# EAGLE design sane_serial (EAGLE 9.6.2)
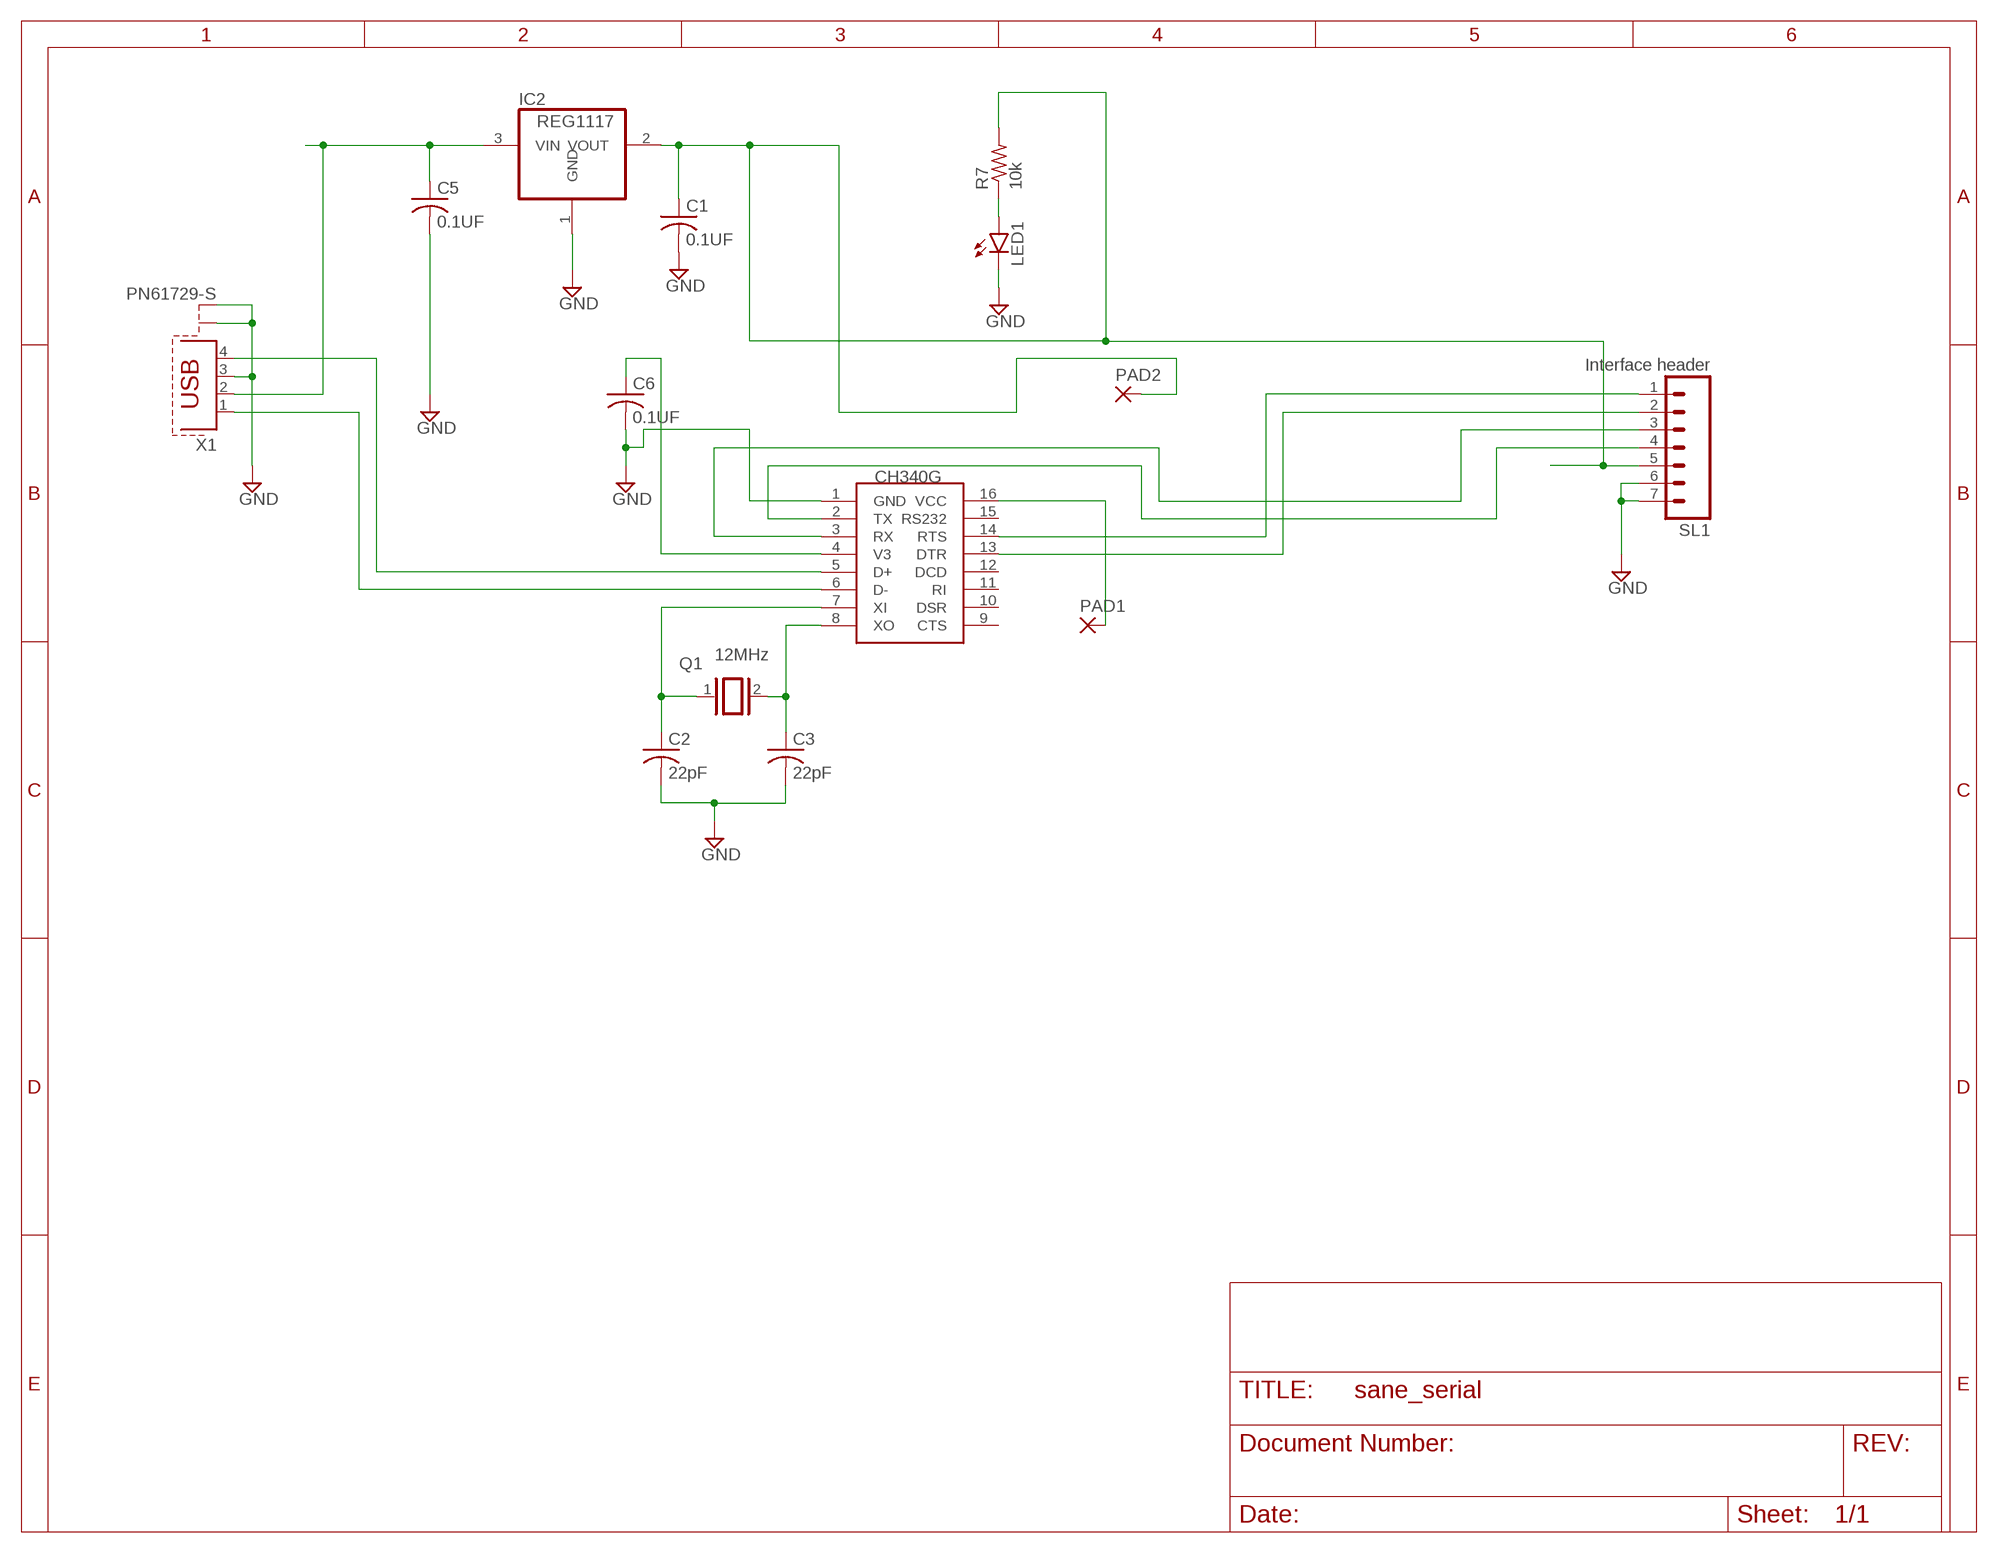
[diagram p0: schematic, sheet 1]

## Parts
C1  0.1UF  C-US050-024X044  [C050-024X044]
C2  22pF  C-US050-024X044  [C050-024X044]
C3  22pF  C-US050-024X044  [C050-024X044]
C5  0.1UF  C-US050-024X044  [C050-024X044]
C6  0.1UF  C-US050-024X044  [C050-024X044]
IC2  REG1117  [SOT223]
LED1  LED5MM  [LED5MM]
PAD1  1,6/0,9  [1,6/0,9]
PAD2  1,6/0,9  [1,6/0,9]
Q1  12MHz  XTAL/S  [QS]
R7  10k  R-US_0204/7  [0204/7]
SL1  Interface header  M07  [07P]
U$1  CH340G  [SOIC16]
X1  PN61729-S  [PN61729-S]

## Nets
GND: C1.2 C2.2 C3.2 C5.2 C6.2 IC2.1(GND) LED1.K(C) SL1.6 SL1.7 U$1.1(GND) X1.3 X1.S1 X1.S2
N$1: U$1.5(D+) X1.4
N$3: SL1.2 U$1.13(DTR)
N$4: SL1.1 U$1.14(RTS)
N$5: SL1.4 U$1.2(TX)
N$6: SL1.3 U$1.3(RX)
N$7: U$1.6(D-) X1.1
N$8: C2.1 Q1.1 U$1.7(XI)
N$9: C3.1 Q1.2 U$1.8(XO)
N$10: C6.1 U$1.4(V3)
N$11: PAD1.1(P) U$1.16(VCC)
N$13: C1.1 IC2.2(VOUT) PAD2.1(P) R7.2 SL1.5
N$14: LED1.A R7.1
N$16: C5.1 IC2.3(VIN) X1.2
Unconnected: U$1.9(CTS) U$1.10(DSR) U$1.11(RI) U$1.12(DCD) U$1.15(RS232)

## Library data of the parts
C1-C3 C5 C6 = rcl:C-US: CAPACITOR, American symbol; SPICEPREFIX: C
IC2 = burr-brown:REG1117: 800mA and 1A Low Dropout (LDO) Positive Regulator 1.8V, 2.5V, 2.85V, 3.3V, 5V, and Adj; MPN: REG1117; OC_FARNELL: 1097566; OC_NEWARK: 14P6981
LED1 = led:LED: LED OSRAM: - CHIPLED LG R971, LG N971, LY N971, LG Q971, LY Q971, LO R971, LY R971 LH N974, LH R974 LS Q976, LO Q976, LY Q976 LO Q996 - Hyper CHIPLED LW Q18S LB Q993, LB Q99A, LB R99A - SideLED LS A670, LO A670, LY A670, LG A670, LP A670 LB A673, LV A673, LT A673, LW A673 LH A674 LY A675 LS A676, LA A676, LO A676, LY A676, LW A676 LS A679, LY A679, LG A679 - Hyper Micro SIDELED® LS Y876, LA Y876, LO Y876, LY Y876 LT Y87S - SmartLED LW L88C, LW L88S LB L89C, LB L89S, LG L890 LS L89K, LO L89K, LY L89K LS L896, LA L896, LO L896, LY L896 - TOPLED LS T670, LO T670, LY T670, LG T670, LP T670 LSG T670, LSP T670, LSY T670, LOP T670, LYG T670 LG T671, LOG T671, LSG T671 LB T673, LV T673, LT T673, LW T673 LH T674 LS T676, LA T676, LO T676, LY T676, LB T676, LH T676, LSB T676, LW T676 LB T67C, LV T67C, LT T67C, LS T67K, LO T67K, LY T67K, LW E67C LS E67B, LA E67B, LO E67B, LY E67B, LB E67C, LV E67C, LT E67C LW T67C LS T679, LY T679, LG T679 LS T770, LO T770, LY T770, LG T770, LP T770 LB T773, LV T773, LT T773, LW T773 LH T774 LS E675, LA E675, LY E675, LS T675 LS T776, LA T776, LO T776, LY T776, LB T776 LHGB T686 LT T68C, LB T68C - Hyper Mini TOPLED® LB M676 - Mini TOPLED Santana® LG M470 LS M47K, LO M47K, LY M47K Source: http://www.osram.convergy.de LUXEON: - LUMILED® LXK2-PW12-R00, LXK2-PW12-S00, LXK2-PW14-U00, LXK2-PW14-V00 LXK2-PM12-R00, LXK2-PM12-S00, LXK2-PM14-U00 LXK2-PE12-Q00, LXK2-PE12-R00, LXK2-PE12-S00, LXK2-PE14-T00, LXK2-PE14-U00 LXK2-PB12-K00, LXK2-PB12-L00, LXK2-PB12-M00, LXK2-PB14-N00, LXK2-PB14-P00, LXK2-PB14-Q00 LXK2-PR12-L00, LXK2-PR12-M00, LXK2-PR14-Q00, LXK2-PR14-R00 LXK2-PD12-Q00, LXK2-PD12-R00, LXK2-PD12-S00 LXK2-PH12-R00, LXK2-PH12-S00 LXK2-PL12-P00, LXK2-PL12-Q00, LXK2-PL12-R00 Source: www.luxeon.com KINGBRIGHT: KA-3528ASYC Source: www.kingbright.com
PAD1 PAD2 = wirepad:1,6/0,9: THROUGH-HOLE PAD
Q1 = special:XTAL/S: CRYSTAL
R7 = rcl:R-US_: RESISTOR, American symbol; SPICEPREFIX: R
SL1 = con-amp-quick:M07: AMP QUICK CONNECTOR; OC_FARNELL: unknown; OC_NEWARK: unknown
U$1 = ch340g:CH340G
X1 = con-berg:PN61729-S: BERG USB connector; OC_FARNELL: unknown; OC_NEWARK: unknown

## Board
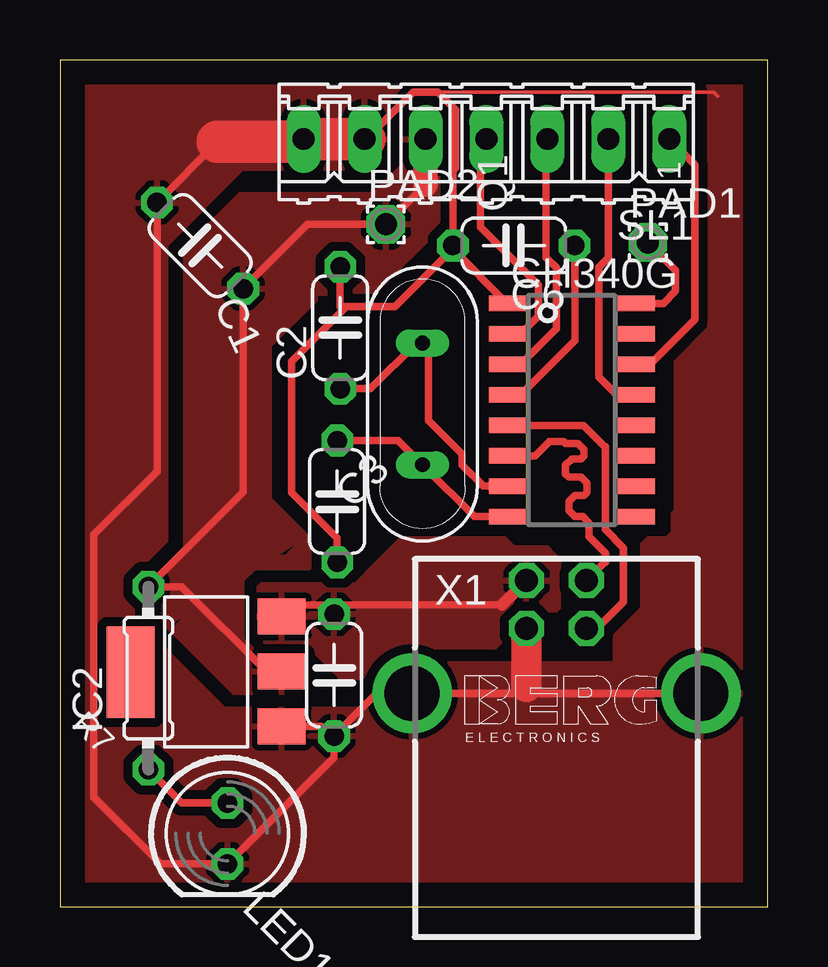
[diagram p1: board, top side]

Size 29.52 x 35.3 mm. Coordinates in mm from the lower left corner, seen from the top.
Outline: 0,0 29.52,0 29.52,35.3 0,35.3 0,0
Copper layers (1*16): Top 0.035mm / dielectric 1.5mm / Bottom 0.035mm
Design rules "default *": minimum track width 6mil, minimum drill 0.35mm, track to track 15mil, track to pad 15mil, pad to pad 15mil, via to via 15mil, smd to smd 15mil, copper to edge 40mil, drill to drill 6mil, minimum pad ring 10mil, minimum via ring 8mil, stop-mask expansion 4mil, vias tented up to drill 0mil, thermal gap 10mil

### Footprints (pad centres in the part's own frame; a part is rotated, then mirrored left to right if it is on the bottom)
C050-024X044 = drill 0.813 octagon: 1 -2.54,0; 2 2.54,0
SOT223 = smd 1.499 x 2.007: 1 -2.261,-3.15; 2 0.025,-3.15; 3 2.311,-3.15 | smd 3.81 x 2.007: 4 0,3.15
LED5MM = drill 0.813 octagon: A -1.27,0; K 1.27,0
1,6/0,9 = drill 0.914 pad 1.6 octagon: 1 0,0
QS = drill 0.61 long: 1 -2.54,0; 2 2.54,0
0204/7 = drill 0.813 octagon: 1 -3.81,0; 2 3.81,0
07P = drill 0.914 long: 1 -7.62,0; 2 -5.08,0; 3 -2.54,0; 4 0,0; 5 2.54,0; 6 5.08,0; 7 7.62,0
SOIC16 = smd 0.635 x 1.524: 1 -4.445,-2.695; 2 -3.175,-2.695; 3 -1.905,-2.695; 4 -0.635,-2.695; 5 0.635,-2.695; 6 1.905,-2.695; 7 3.175,-2.695; 8 4.445,-2.695; 9 4.445,2.695; 10 3.175,2.695; 11 1.905,2.695; 12 0.635,2.695; 13 -0.635,2.695; 14 -1.905,2.695; 15 -3.175,2.695; 16 -4.445,2.695
PN61729-S = drill 0.95 octagon: 1 1.25,4.71; 2 -1.25,4.71; 3 -1.25,2.71; 4 1.25,2.71 | drill 2.3 pad 2.9: S1 -6.02,0; S2 6.02,0

### Placement (x,y rotation side)
C1  5.84,27.56 135 top
C2  11.68,24.13 90 top
C3  11.56,16.89 270 top
C5  11.43,9.65 270 top
C6  18.92,27.56 180 top
IC2  6.1,9.78 90 top
LED1  6.99,3.05 270 top
PAD1  24.51,27.69 0 top
PAD2  13.59,28.45 0 top
Q1  15.11,20.96 270 top
R7  3.68,9.52 90 top
SL1  17.78,32 180 top
U$1  21.34,20.7 270 top
X1  20.7,8.89 0 top

### Tracks (layer width: path | path; a pad name or v marks a point on that pad's centre or on a via)
GND
  Top 0.152: 15.37,33.96 27.25,33.96 27.43,33.78
  Top 0.305: X1.S2 19.18,8.89 | 19.45,9.16 19.18,8.89 | SL1.7 10.23,31.89 | 19.18,8.89 X1.S1 13.21,8.89 C5.2 11.43,6.99 | C6.2 16.38,27.43 13.97,25.02 11.94,25.02 | 11.94,25.02 11.68,25.02 C2.2 | 11.94,25.02 9.65,22.73 9.65,17.27 11.56,15.37 C3.2 | C6.2 16.38,30.68 16.48,30.78 16.48,33.23 15.76,33.96 15.37,33.96 14.72,33.96 12.77,32 SL1.6 | U$1.1 16.38,27.4 C6.2 | 11.43,6.99 11.43,6.22 LED1.K 4.19,1.78 1.41,4.56 1.41,15.51 4.05,18.14 C1.2 6.58,31.89 | IC2.1 10.9,7.52 11.43,6.99
  Top 1.27: X1.3 19.45,9.16
  Top 1.778: 6.58,31.89 10.23,31.89 | SL1.7 SL1.6
  pour Top: 26.92,34.29 29.34,34.29 29.46,34.16 29.46,0.51 29.08,0.13 23.11,0.13 23.11,11.3 23.24,11.43 24.26,12.45 24.26,15.11 24.51,15.37 25.27,15.37 25.53,15.62 25.53,16.38 25.65,16.51 25.65,22.73 27.05,24.13 27.05,25.91 27.05,34.16
  pour Top: 14.99,10.16 22.99,10.16 22.99,0.64 0.25,0.64 0.25,12.19 2.92,12.19 6.86,8.25 12.45,8.25 13.08,8.89 13.72,8.89
  pour Top: 14.1,34.04 13.72,33.65 13.72,31.24 13.21,30.73 7.62,30.73 4.45,27.56 4.45,15.24 3.05,13.84 3.05,12.19 0.38,12.19 0.38,35.05 13.72,35.05 14.1,34.67
N$1
  Top 0.305: X1.4 22.39,11.6 23.5,12.7 23.5,14.96 22.74,15.72 22.74,19.18 22.71,19.18 21.82,20.07 U$1.5
N$3
  Top 0.305: U$1.13 23.99,21.37 23.18,21.37 22.48,22.07 22.48,26.67 22.86,27.05 SL1.2
N$4
  Top 0.305: U$1.14 24.12,22.52 24.51,22.52 26.47,24.48 26.47,30.94 SL1.1
N$5
  Top 0.305: SL1.4 17.53,31.75 17.53,28.32 19.94,25.91 19.94,24.61 19.24,23.91 18.68,23.91 U$1.2
N$6
  Top 0.305: U$1.3 18.68,22.64 19.24,22.64 20.7,24.1 20.7,26.63 20.27,27.07 20.27,31.95 SL1.3
N$7
  Top 0.305: X1.1 22.7,14.35 22.73,14.35 22.73,14.75 22.05,15.43 22.05,16 21.8,16.26 21.46,16.26 21.21,16.51 21.21,16.89 21.46,17.14 21.84,17.14 21.97,17.27 21.97,17.65 21.72,17.91 21.21,17.91 21.08,18.03 21.08,18.42 21.34,18.67 21.72,18.67 21.84,18.8 21.84,19.05 21.59,19.3 21.08,19.3 21.01,19.38 20.4,19.38 19.81,18.8 U$1.6
N$8
  Top 0.305: U$1.7 17.65,17.53 16.76,18.42 16.76,18.87 15.37,20.26 15.37,23.24 Q1.1 14.86,23.5 12.95,21.59 C2.1
N$9
  Top 0.305: U$1.8 17.27,16.26 15.18,18.35 Q1.2 14.1,19.43 C3.1
N$10
  Top 0.305: U$1.4 18.73,21.25 19.12,21.25 21.46,23.59 C6.1
N$11
  Top 0.305: PAD1.1 25.65,26.54 25.65,25.65 25.15,25.15 U$1.16
N$13
  Top 0.305: 15.24,30.99 15.24,30.73 | IC2.2 8.61,9.8 5.08,13.33 R7.2 7.64,17.29 C1.1 10.32,28.45 PAD2.1 15.24,30.1
  Top 1.016: SL1.5 15.24,30.99 | 15.24,30.1 15.24,30.73
  pour Top: 10.29,15.49 8.76,17.02 8.76,23.37 10.67,25.27 10.67,25.53 13.08,25.53 16,28.45 16,33.15 15.75,33.4 14.86,33.4 14.35,32.89 14.35,30.99 13.08,29.72 7.49,29.72 5.21,27.43 5.21,14.86 3.81,13.46 4.32,12.95 4.32,11.64
  pour Top: 4.45,11.68 7.24,8.89 10.03,8.89 10.03,10.16 8.64,10.16 7.62,11.18 7.62,13.59 8.13,14.1 10.41,14.1 10.41,15.37 10.29,15.49 9.4,14.6 7.75,14.6 4.83,11.68
N$14
  Top 0.305: LED1.A 5.08,4.32 R7.1
N$16
  Top 0.305: 18.44,12.58 11.82,12.58 | C5.1 11.82,12.58 | IC2.3 9.74,12.58 11.82,12.58
  Top 0.508: X1.2 18.44,12.58
  pour Top: 19.69,12.32 20.7,12.32 20.83,12.45 20.83,14.48 20.57,14.73 20.32,14.99 18.92,14.99 18.54,15.37 16.76,15.37 14.22,15.37 13.21,14.35 12.32,13.46 11.68,13.46 8.38,13.46 8.26,13.33 8.26,11.3 8.76,10.79 9.78,10.79 10.41,10.79 10.79,10.41 11.56,9.65 11.68,9.52 12.57,9.52 13.84,10.79 16.76,10.79 18.16,10.79